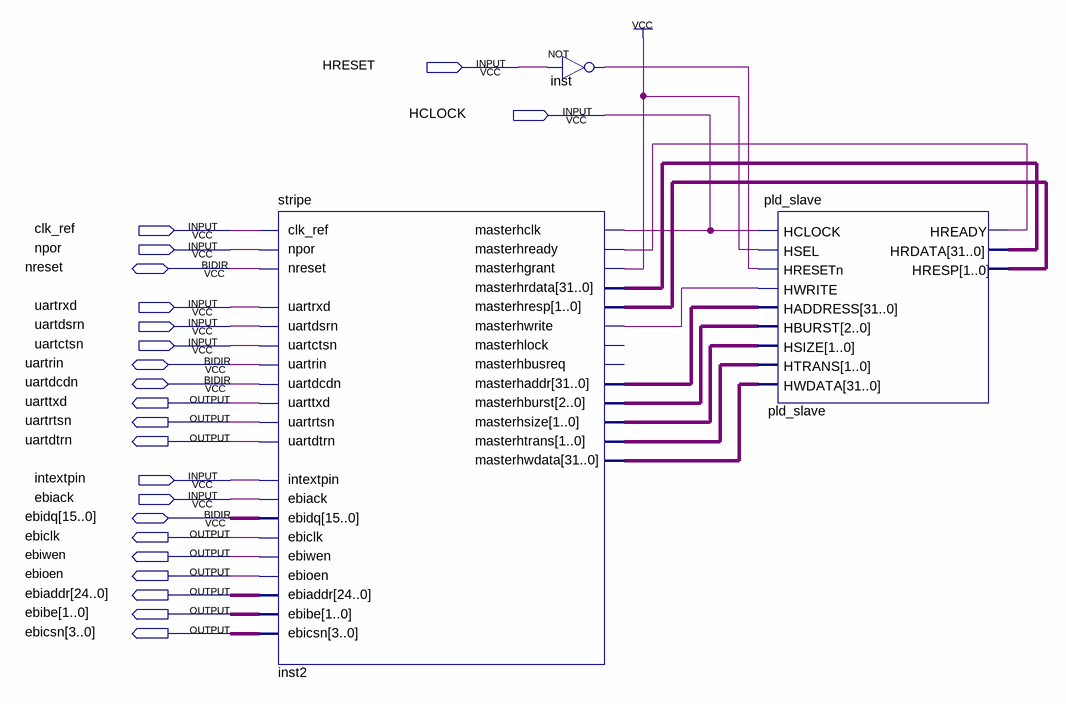
[diagram p0: schematic sheet]
// Quartus schematic arm_top.bdf as structural Verilog: 3 symbols, 22 pins
module arm_top (
  input  HRESET,
  input  HCLOCK,
  input  clk_ref,
  input  npor,
  input  uartrxd,
  input  uartdsrn,
  input  uartctsn,
  input  intextpin,
  input  ebiack,
  inout  nreset,
  inout  uartrin,
  inout  uartdcdn,
  inout  [15:0] ebidq,
  output uarttxd,
  output uartrtsn,
  output uartdtrn,
  output ebiclk,
  output ebiwen,
  output ebioen,
  output [24:0] ebiaddr,
  output [1:0] ebibe,
  output [3:0] ebicsn
);

  wire inst2_masterhwrite, inst_out, pld_slave_hready;
  wire [1:0] inst2_masterhsize, inst2_masterhtrans, pld_slave_hresp;
  wire [2:0] inst2_masterhburst;
  wire [31:0] inst2_masterhaddr, inst2_masterhwdata, pld_slave_hrdata;

  stripe inst2 (
    .clk_ref(clk_ref), .npor(npor), .uartrxd(uartrxd), .uartdsrn(uartdsrn), .uartctsn(uartctsn),
    .intextpin(intextpin), .ebiack(ebiack), .masterhclk(HCLOCK), .masterhready(pld_slave_hready),
    .masterhgrant(1'b1), .masterhrdata(pld_slave_hrdata), .masterhresp(pld_slave_hresp), .uarttxd(uarttxd),
    .uartrtsn(uartrtsn), .uartdtrn(uartdtrn), .ebiclk(ebiclk), .ebiwen(ebiwen), .ebioen(ebioen),
    .ebiaddr(ebiaddr), .ebibe(ebibe), .ebicsn(ebicsn), .masterhwrite(inst2_masterhwrite),
    .masterhaddr(inst2_masterhaddr), .masterhburst(inst2_masterhburst), .masterhsize(inst2_masterhsize),
    .masterhtrans(inst2_masterhtrans), .masterhwdata(inst2_masterhwdata), .nreset(nreset), .uartrin(uartrin),
    .uartdcdn(uartdcdn), .ebidq(ebidq));  // open: masterhlock, masterhbusreq
  not inst (inst_out, HRESET);
  pld_slave pld_slave (
    .HCLOCK(HCLOCK), .HSEL(1'b1), .HRESETn(inst_out), .HWRITE(inst2_masterhwrite),
    .HADDRESS(inst2_masterhaddr), .HBURST(inst2_masterhburst), .HSIZE(inst2_masterhsize),
    .HTRANS(inst2_masterhtrans), .HWDATA(inst2_masterhwdata), .HREADY(pld_slave_hready),
    .HRDATA(pld_slave_hrdata), .HRESP(pld_slave_hresp));
endmodule
